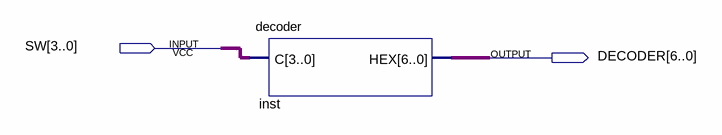
[diagram p0: schematic sheet]
// Quartus schematic lab1.bdf as structural Verilog: 1 symbols, 2 pins
module lab1 (
  input  [3:0] SW,
  output [6:0] DECODER
);

  decoder inst (.C(SW), .HEX(DECODER));
endmodule
